# Altium schematic sheet NIRController.SchDoc
size A3
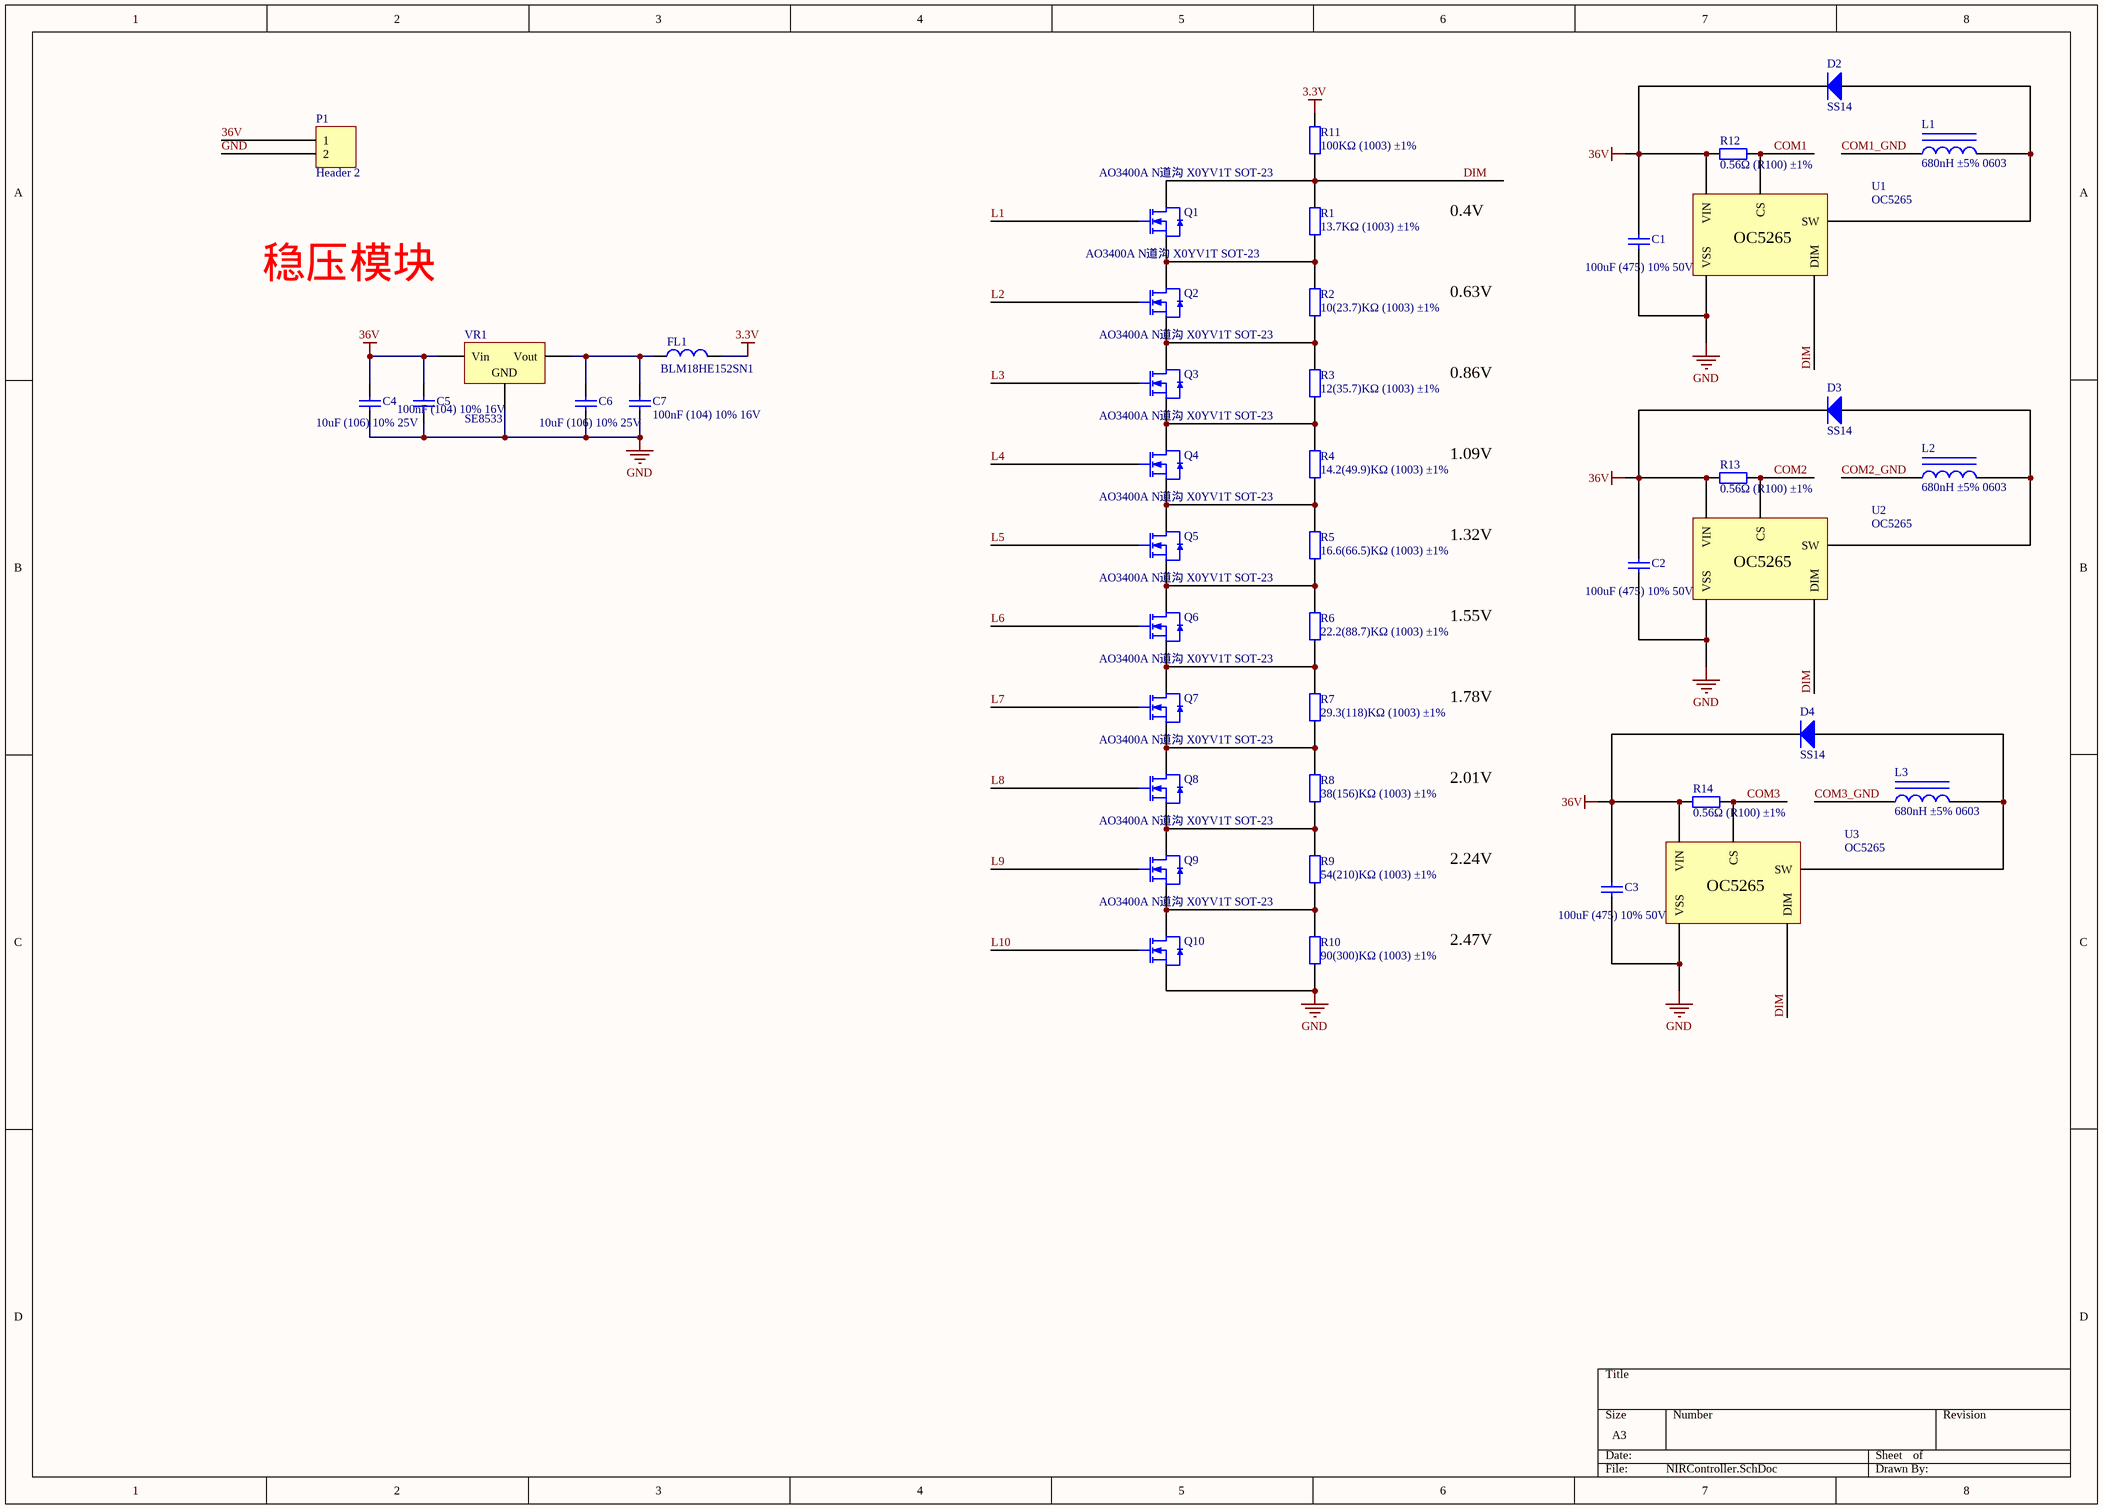
[diagram p0: NIRController.SchDoc]

## Parts
C1  100uF (475) 10% 50V  [1206_C]
C2  100uF (475) 10% 50V  [1206_C]
C3  100uF (475) 10% 50V  [1206_C]
C4  10uF (106) 10% 25V  [0603_C]
C5  100nF (104) 10% 16V  [0603_C]
C6  10uF (106) 10% 25V  [0603_C]
C7  100nF (104) 10% 16V  [0603_C]
D2  SS14  [SMA(DO-214AC)_S1]
D3  SS14  [SMA(DO-214AC)_S1]
D4  SS14  [SMA(DO-214AC)_S1]
FL1  BLM18HE152SN1  [0603_L]
L1  680nH ±5% 0603  [0603_L]
L2  680nH ±5% 0603  [0603_L]
L3  680nH ±5% 0603  [0603_L]
P1  Header 2  [HDR1X2]
Q1  AO3400A N道沟 X0YV1T SOT-23  [SOT-23-3L]
Q2  AO3400A N道沟 X0YV1T SOT-23  [SOT-23-3L]
Q3  AO3400A N道沟 X0YV1T SOT-23  [SOT-23-3L]
Q4  AO3400A N道沟 X0YV1T SOT-23  [SOT-23-3L]
Q5  AO3400A N道沟 X0YV1T SOT-23  [SOT-23-3L]
Q6  AO3400A N道沟 X0YV1T SOT-23  [SOT-23-3L]
Q7  AO3400A N道沟 X0YV1T SOT-23  [SOT-23-3L]
Q8  AO3400A N道沟 X0YV1T SOT-23  [SOT-23-3L]
Q9  AO3400A N道沟 X0YV1T SOT-23  [SOT-23-3L]
Q10  AO3400A N道沟 X0YV1T SOT-23  [SOT-23-3L]
R1  13.7KΩ (1003) ±1%  [0603_R]
R2  10(23.7)KΩ (1003) ±1%  [0603_R]
R3  12(35.7)KΩ (1003) ±1%  [0603_R]
R4  14.2(49.9)KΩ (1003) ±1%  [0603_R]
R5  16.6(66.5)KΩ (1003) ±1%  [0603_R]
R6  22.2(88.7)KΩ (1003) ±1%  [0603_R]
R7  29.3(118)KΩ (1003) ±1%  [0603_R]
R8  38(156)KΩ (1003) ±1%  [0603_R]
R9  54(210)KΩ (1003) ±1%  [0603_R]
R10  90(300)KΩ (1003) ±1%  [0603_R]
R11  100KΩ (1003) ±1%  [0603_R]
R12  0.56Ω (R100) ±1%  [1206_R]
R13  0.56Ω (R100) ±1%  [1206_R]
R14  0.56Ω (R100) ±1%  [1206_R]
U1  OC5265  [SOT-89-5]
U2  OC5265  [SOT-89-5]
U3  OC5265  [SOT-89-5]
VR1  SE8533  [SOT-223]

## Nets
3.3V: FL1.2 R11.1
36V: C1.2 C2.2 C3.2 C4.2 C5.2 D2.2(K) D3.2(K) D4.2(K) P1.1 R12.1 R13.1 R14.1 U1.VIN U2.VIN U3.VIN VR1.3(Vin)
GND: C1.1 C2.1 C3.1 C4.1 C5.1 C6.1 C7.1 P1.2 Q10.2(S) R10.1 U1.VSS U2.VSS U3.VSS VR1.1(GND)
COM1: R12.2 U1.CS
COM1_GND: L1.1
COM2: R13.2 U2.CS
COM2_GND: L2.1
COM3: R14.2 U3.CS
COM3_GND: L3.1
DIM: Q1.3(D) R1.2 R11.2 U1.DIM U2.DIM U3.DIM
L1: Q1.1(G)
L2: Q2.1(G)
L3: Q3.1(G)
L4: Q4.1(G)
L5: Q5.1(G)
L6: Q6.1(G)
L7: Q7.1(G)
L8: Q8.1(G)
L9: Q9.1(G)
L10: Q10.1(G)
NetC6_2: C6.2 C7.2 FL1.1 VR1.2(Vout)
NetD2_1: D2.1(A) L1.2 U1.SW
NetD3_1: D3.1(A) L2.2 U2.SW
NetD4_1: D4.1(A) L3.2 U3.SW
NetQ1_2: Q1.2(S) Q2.3(D) R1.1 R2.2
NetQ2_2: Q2.2(S) Q3.3(D) R2.1 R3.2
NetQ3_2: Q3.2(S) Q4.3(D) R3.1 R4.2
NetQ4_2: Q4.2(S) Q5.3(D) R4.1 R5.2
NetQ5_2: Q5.2(S) Q6.3(D) R5.1 R6.2
NetQ6_2: Q6.2(S) Q7.3(D) R6.1 R7.2
NetQ7_2: Q7.2(S) Q8.3(D) R7.1 R8.2
NetQ8_2: Q8.2(S) Q9.3(D) R8.1 R9.2
NetQ9_2: Q9.2(S) Q10.3(D) R9.1 R10.2

## Notes on the sheet
- 0.4V
- 稳压模块
- 0.63V
- 0.86V
- 1.09V
- 1.32V
- 1.55V
- 1.78V
- 2.01V
- 2.24V
- 2.47V

## Library data of the parts
C1-C3 = 1206 4.7uF (475) 10% 50V: 贴片电容; ComponentLink1Description: 供应商链接; ComponentLink1URL: http://www.szlcsc.com/product/details_30577.html; Package: 1206; Supplier: LC; SuppliersPartNumber: C29823
C4 C6 = 0805 10uF (106) 10% 25V: 贴片电容; ComponentLink1Description: 供应商链接; ComponentLink1URL: http://www.szlcsc.com/product/details_16532.html; Package: 0805; Supplier: LC; SuppliersPartNumber: C15850
C5 C7 = 0402 100nF (104) 10% 16V: 贴片电容; ComponentLink1Description: 供应商链接; ComponentLink1URL: http://www.szlcsc.com/product/details_1877.html; Package: 0402; Supplier: LC; SuppliersPartNumber: C1525
D2-D4 = SMA(DO-214AC) SS54: 二极管; ComponentLink1Description: 供应商链接; ComponentLink1URL: http://www.szlcsc.com/product/details_23178.html; Package: SMA(DO-214AC); Supplier: LC; SuppliersPartNumber: C22452
FL1 = IND_DM_1MH_2.5A: 差模电感1mH/2.5A; Text Field1: 29.5mm; Text Field2: 43120014; Text Field3: HI
L1-L3 = 0603 68nH 5% 0603: 贴片电感; ComponentLink1Description: 供应商链接; ComponentLink1URL: http://www.szlcsc.com/product/details_14064.html; Package: 0603; Supplier: LC; SuppliersPartNumber: C13415
P1 = Header 2: Header, 2-Pin; LatestRevisionDate: 17-Jul-2002; LatestRevisionNote: Re-released for DXP Platform.; Publisher: Altium Limited
Q1-Q10 = AO3400A N道沟 X0YV1T SOT-23: MOS(场效应管); ComponentLink1Description: 供应商链接; ComponentLink1URL: http://www.szlcsc.com/product/details_21629.html; Package: SOT-23; Supplier: LC; SuppliersPartNumber: C20917
R1-R11 = 0603 100KΩ (1003) 1%: 贴片电阻; ComponentLink1Description: 供应商链接; ComponentLink1URL: http://www.szlcsc.com/product/details_26546.html; Package: 0603; Supplier: LC; SuppliersPartNumber: C25803
R12-R14 = 1206 0.1Ω (R100) 1%: 贴片电阻; ComponentLink1Description: 供应商链接; ComponentLink1URL: http://www.szlcsc.com/product/details_26077.html; Package: 1206; Supplier: LC; SuppliersPartNumber: C25334
U1-U3 = OC5265: pin to pad: CS>4 DIM>3 SW>1 VIN>5 VSS>2
VR1 = SOT-223 AMS1117-3.3: 低压差线性稳压(LDO); ComponentLink1Description: 供应商链接; ComponentLink1URL: http://www.szlcsc.com/product/details_6652.html; Package: SOT-223; Supplier: LC; SuppliersPartNumber: C6186